# Altium schematic sheet drvoutput5.SchDoc
size A4
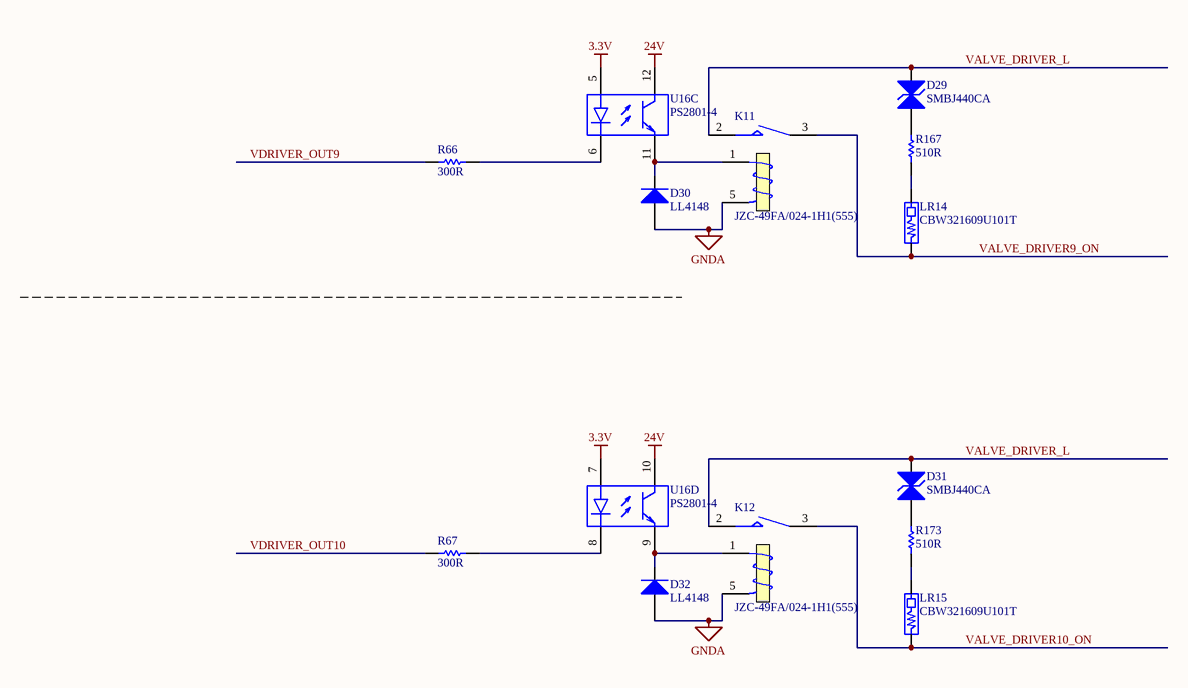
[diagram p0: drvoutput5.SchDoc]

## Parts
D29  SMBJ440CA  [SMB]
D30  LL4148  [CD2012-0805]
D31  SMBJ440CA  [SMB]
D32  LL4148  [CD2012-0805]
K11  JZC-49FA/024-1H1(555)  [JZC-49FA]
K12  JZC-49FA/024-1H1(555)  [JZC-49FA]
LR14  CBW321609U101T  [INDC3216M]
LR15  CBW321609U101T  [INDC3216M]
R66  300R  [RESC2012M]
R67  300R  [RESC2012M]
R167  510R  [RESC3216M]
R173  510R  [RESC3216M]
U16  PS2801-4  [SOIC16_N]  (parts C,D of 4)

## Nets
3.3V: U16.5(+) U16.7(+)
24V: U16.10(C) U16.12(C)
GNDA: D30.1(A) D32.1(A) K11.5(T2) K12.5(T2)
VALVE_DRIVER9_ON: K11.3(NO) LR14.1
VALVE_DRIVER10_ON: K12.3(NO) LR15.1
VALVE_DRIVER_L: D29.2(K) D31.2(K) K11.2(COM) K12.2(COM)
VDRIVER_OUT9: R66.1
VDRIVER_OUT10: R67.1
NetD29_1: D29.1(A) R167.2
NetD30_2: D30.2(K) K11.1 U16.11(E)
NetD31_1: D31.1(A) R173.2
NetD32_2: D32.2(K) K12.1 U16.9(E)
NetLR14_2: LR14.2 R167.1
NetLR15_2: LR15.2 R173.1
NetR66_2: R66.2 U16.6(-)
NetR67_2: R67.2 U16.8(-)

## Library data of the parts
D29 D31 = Bi-dir TVS Diode: Published: 8-Jun-2000; LatestRevisionDate: 17-Jul-2002; LatestRevisionNote: Re-released for DXP Platform.; PackageReference: DIODE-0.7; Publisher: Altium Limited
D30 D32 = Diode 1N4007: 1 Amp General Purpose Rectifier; Published: 8-Jun-2000; LatestRevisionDate: 17-Jul-2002; LatestRevisionNote: Re-released for DXP Platform.; DatasheetVersion: 1998; PackageVersion: Aug-1999; PackageReference: DO-41; Publisher: Altium Limited; Code_JEDEC: DO-204-AL; ComponentLink1Description: Manufacturer Link; ComponentLink1URL: http://www.fairchildsemi.com/; ComponentLink2Description: Datasheet; ComponentLink2URL: http://www.fairchildsemi.com/ds/1N%2F1N4001.pdf
K11 K12 = JZC-49FA: Intermediate  Power  Relay; Published: 8-Jun-2000; LatestRevisionDate: 17-Jul-2002; LatestRevisionNote: Re-released for DXP Platform.; PackageReference: MODULE5B; Publisher: Altium Limited
LR14 LR15 = BLM10/11/21/31/41: EMI FILTERS,DC Resistance max.0.05~1.5 ohms,10 ~ 1000 ohms at 100MHz  Frequency
R66 R67 = Res1: Resistor; Value: 10K; Published: 8-Jun-2000; LatestRevisionDate: 17-Jul-2002; LatestRevisionNote: Re-released for DXP Platform.; PackageReference: AXIAL-0.3; Publisher: Altium Limited
R167 R173 = Res1: Metal film Resistor; Value: 10K; Published: 8-Jun-2000; LatestRevisionDate: 17-Jul-2002; LatestRevisionNote: Re-released for DXP Platform.; PackageReference: AXIAL-0.3; Publisher: Altium Limited
U16 = PS2801-4: The PS2801-1 and PS2801-4 are optically coupled isolators containing a GaAs light emitting diode and an NPN  silicon phototransistor in a plastic SOP for high density applications.; Published: 28-Feb-2003; LatestRevisionDate: 13-Apr-2006; LatestRevisionNote: IPC-7351 Footprint Added.; DatasheetVersion: Jan-2002, Rev. 7; PackageVersion: rev7, Jan-2002; PackageReference: 751-07; Publisher: Altium Limited; PackageDescription: 8-Pin Plastic Small Outline Integrated Circuit 1.27 mm Pitch; Code_JEDEC: MS-012-AA; Code_IPC: SOIC127P600-8; ComponentLink1Description: Manufacturer Link; ComponentLink1URL: http://www.onsemi.com/; ComponentLink2Description: Datasheet; ComponentLink2URL: http://www.onsemi.com/pub/Collateral/LM358-D.PDF